# EasyEDA schematic 1-Schematic_OrionPRO-Original.json, sheets 1 to 2 of 6

## Sheets
1 MainModule: TITLE: Orion-PRO Основной модуль; REV: 3.21; Date: 2021-06-17; Sheet: 1/6; Drawn By: Romych; Company: zx-pk.ru
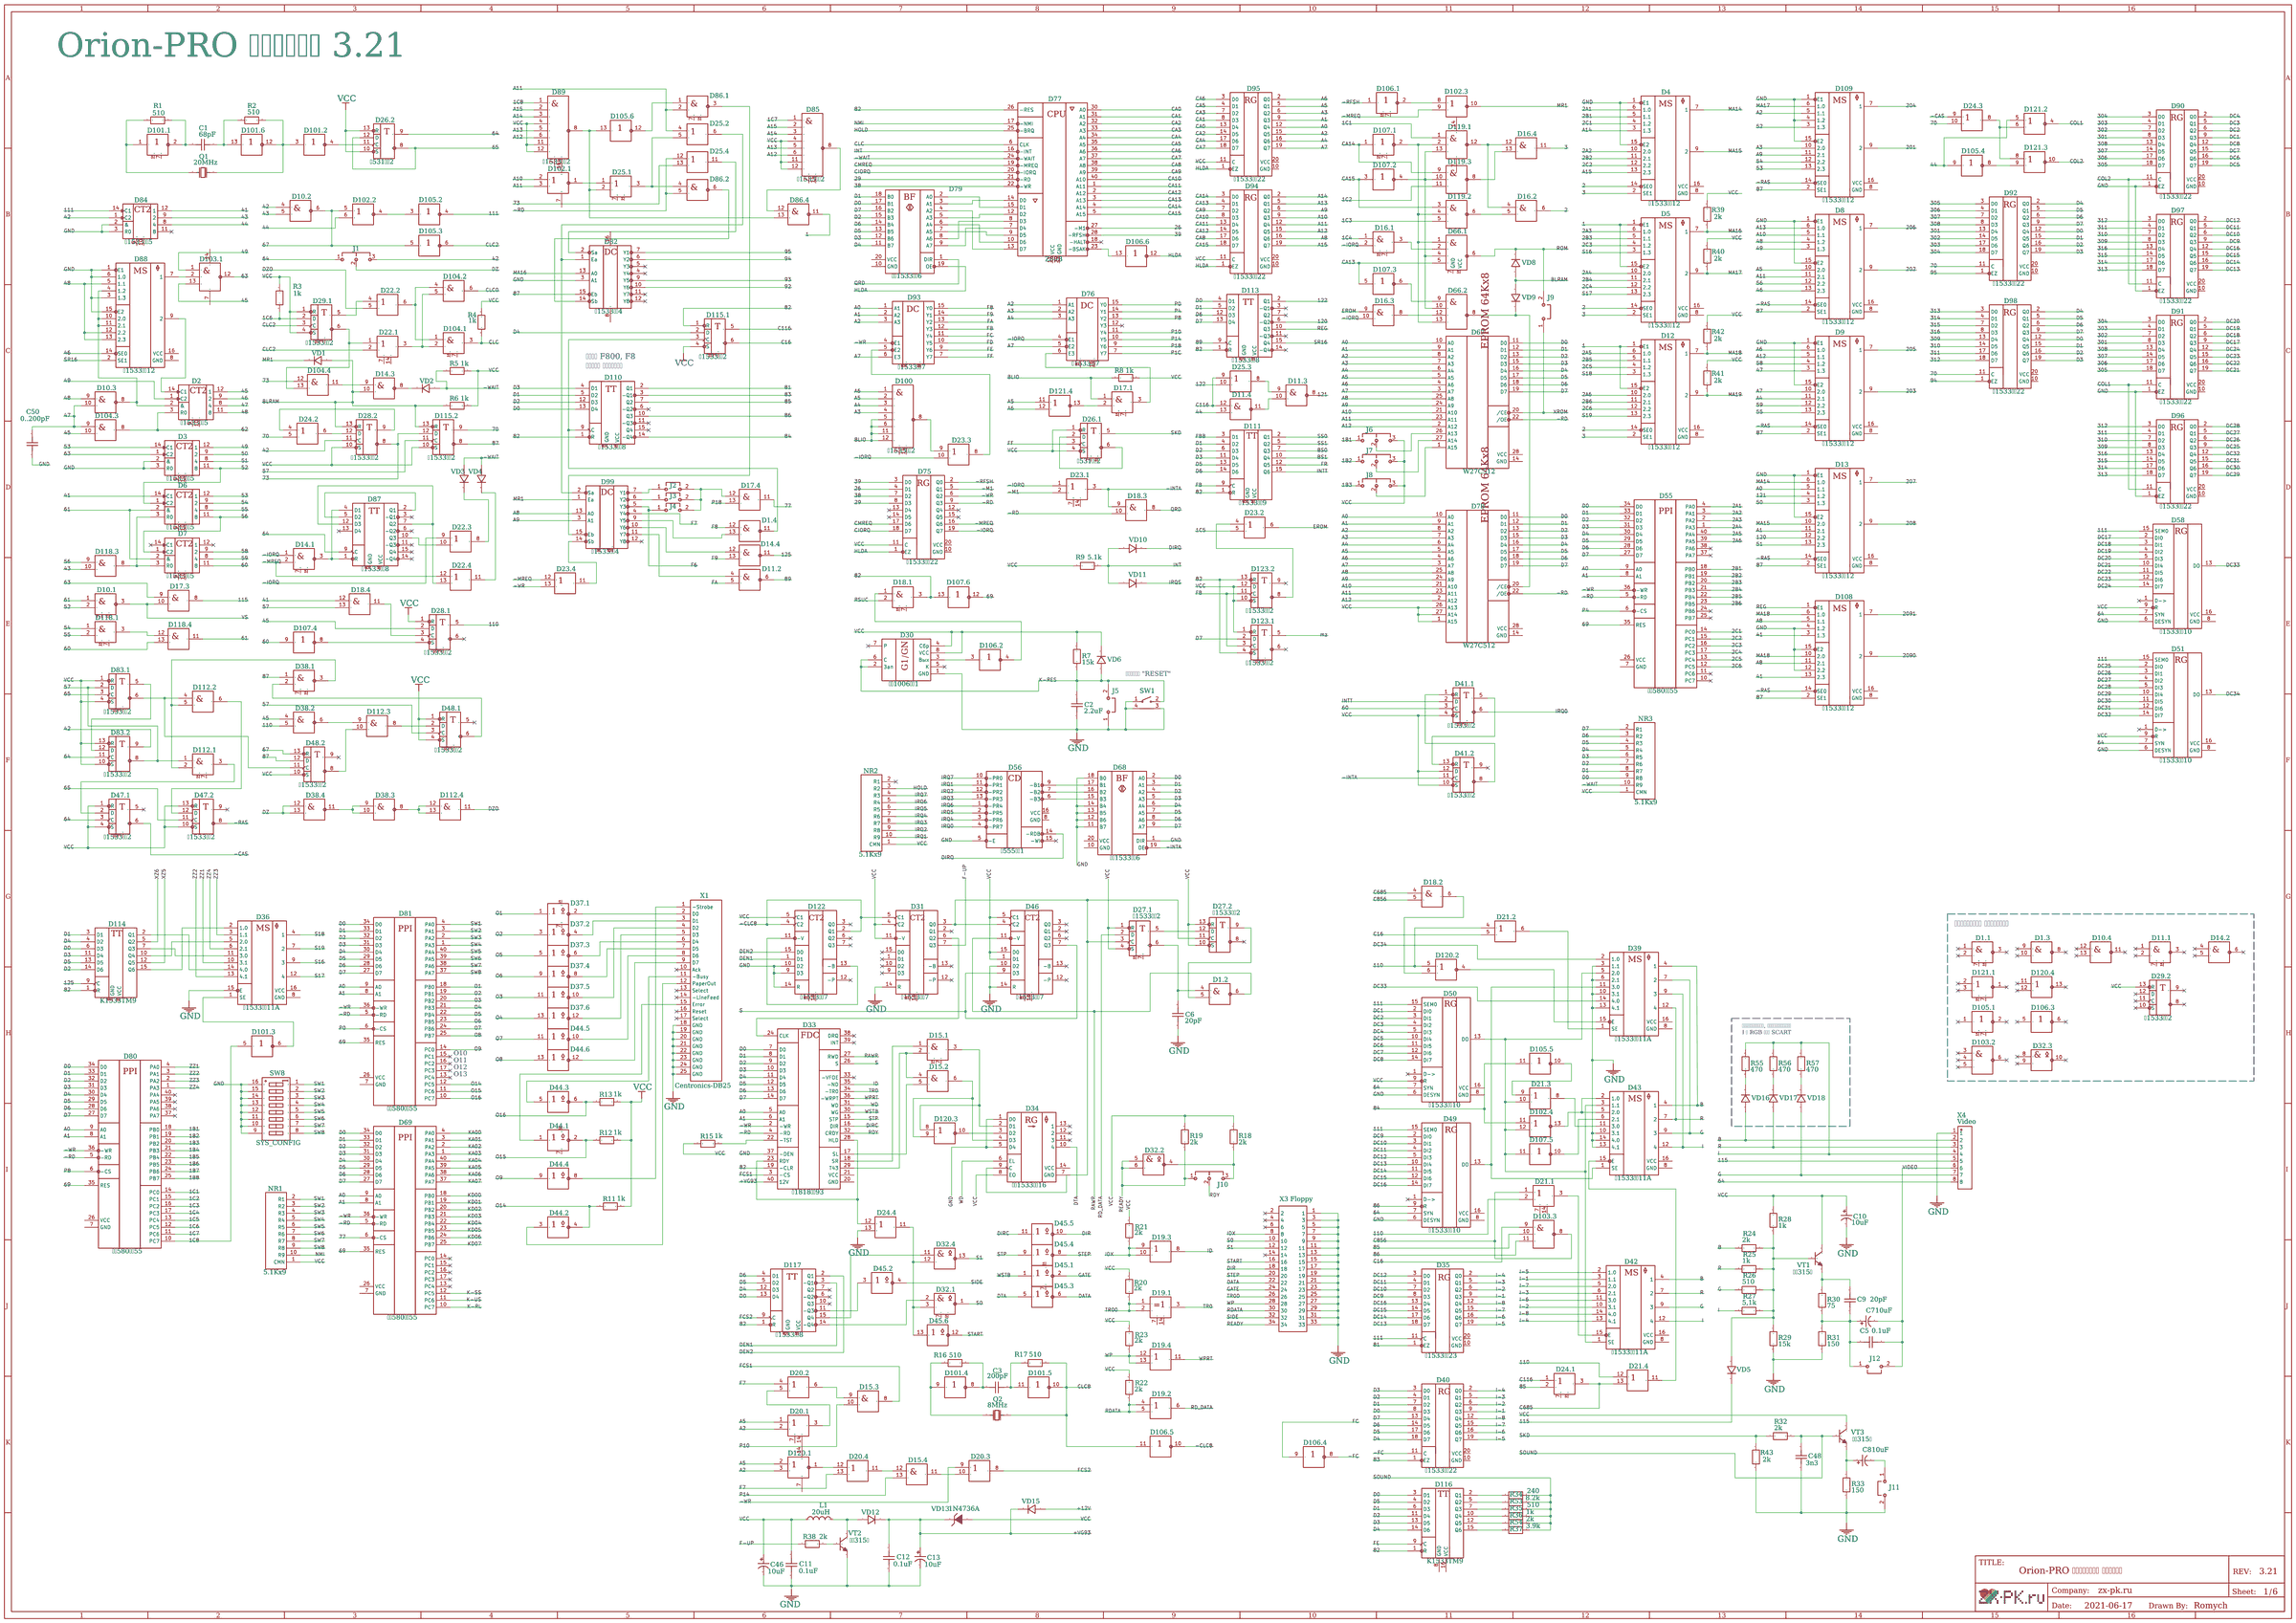
[diagram p0: MainModule]
2 MemoryModule: TITLE: Orion-PRO Динамическое ОЗУ; Date: 2021-10-23; Sheet: 2/6
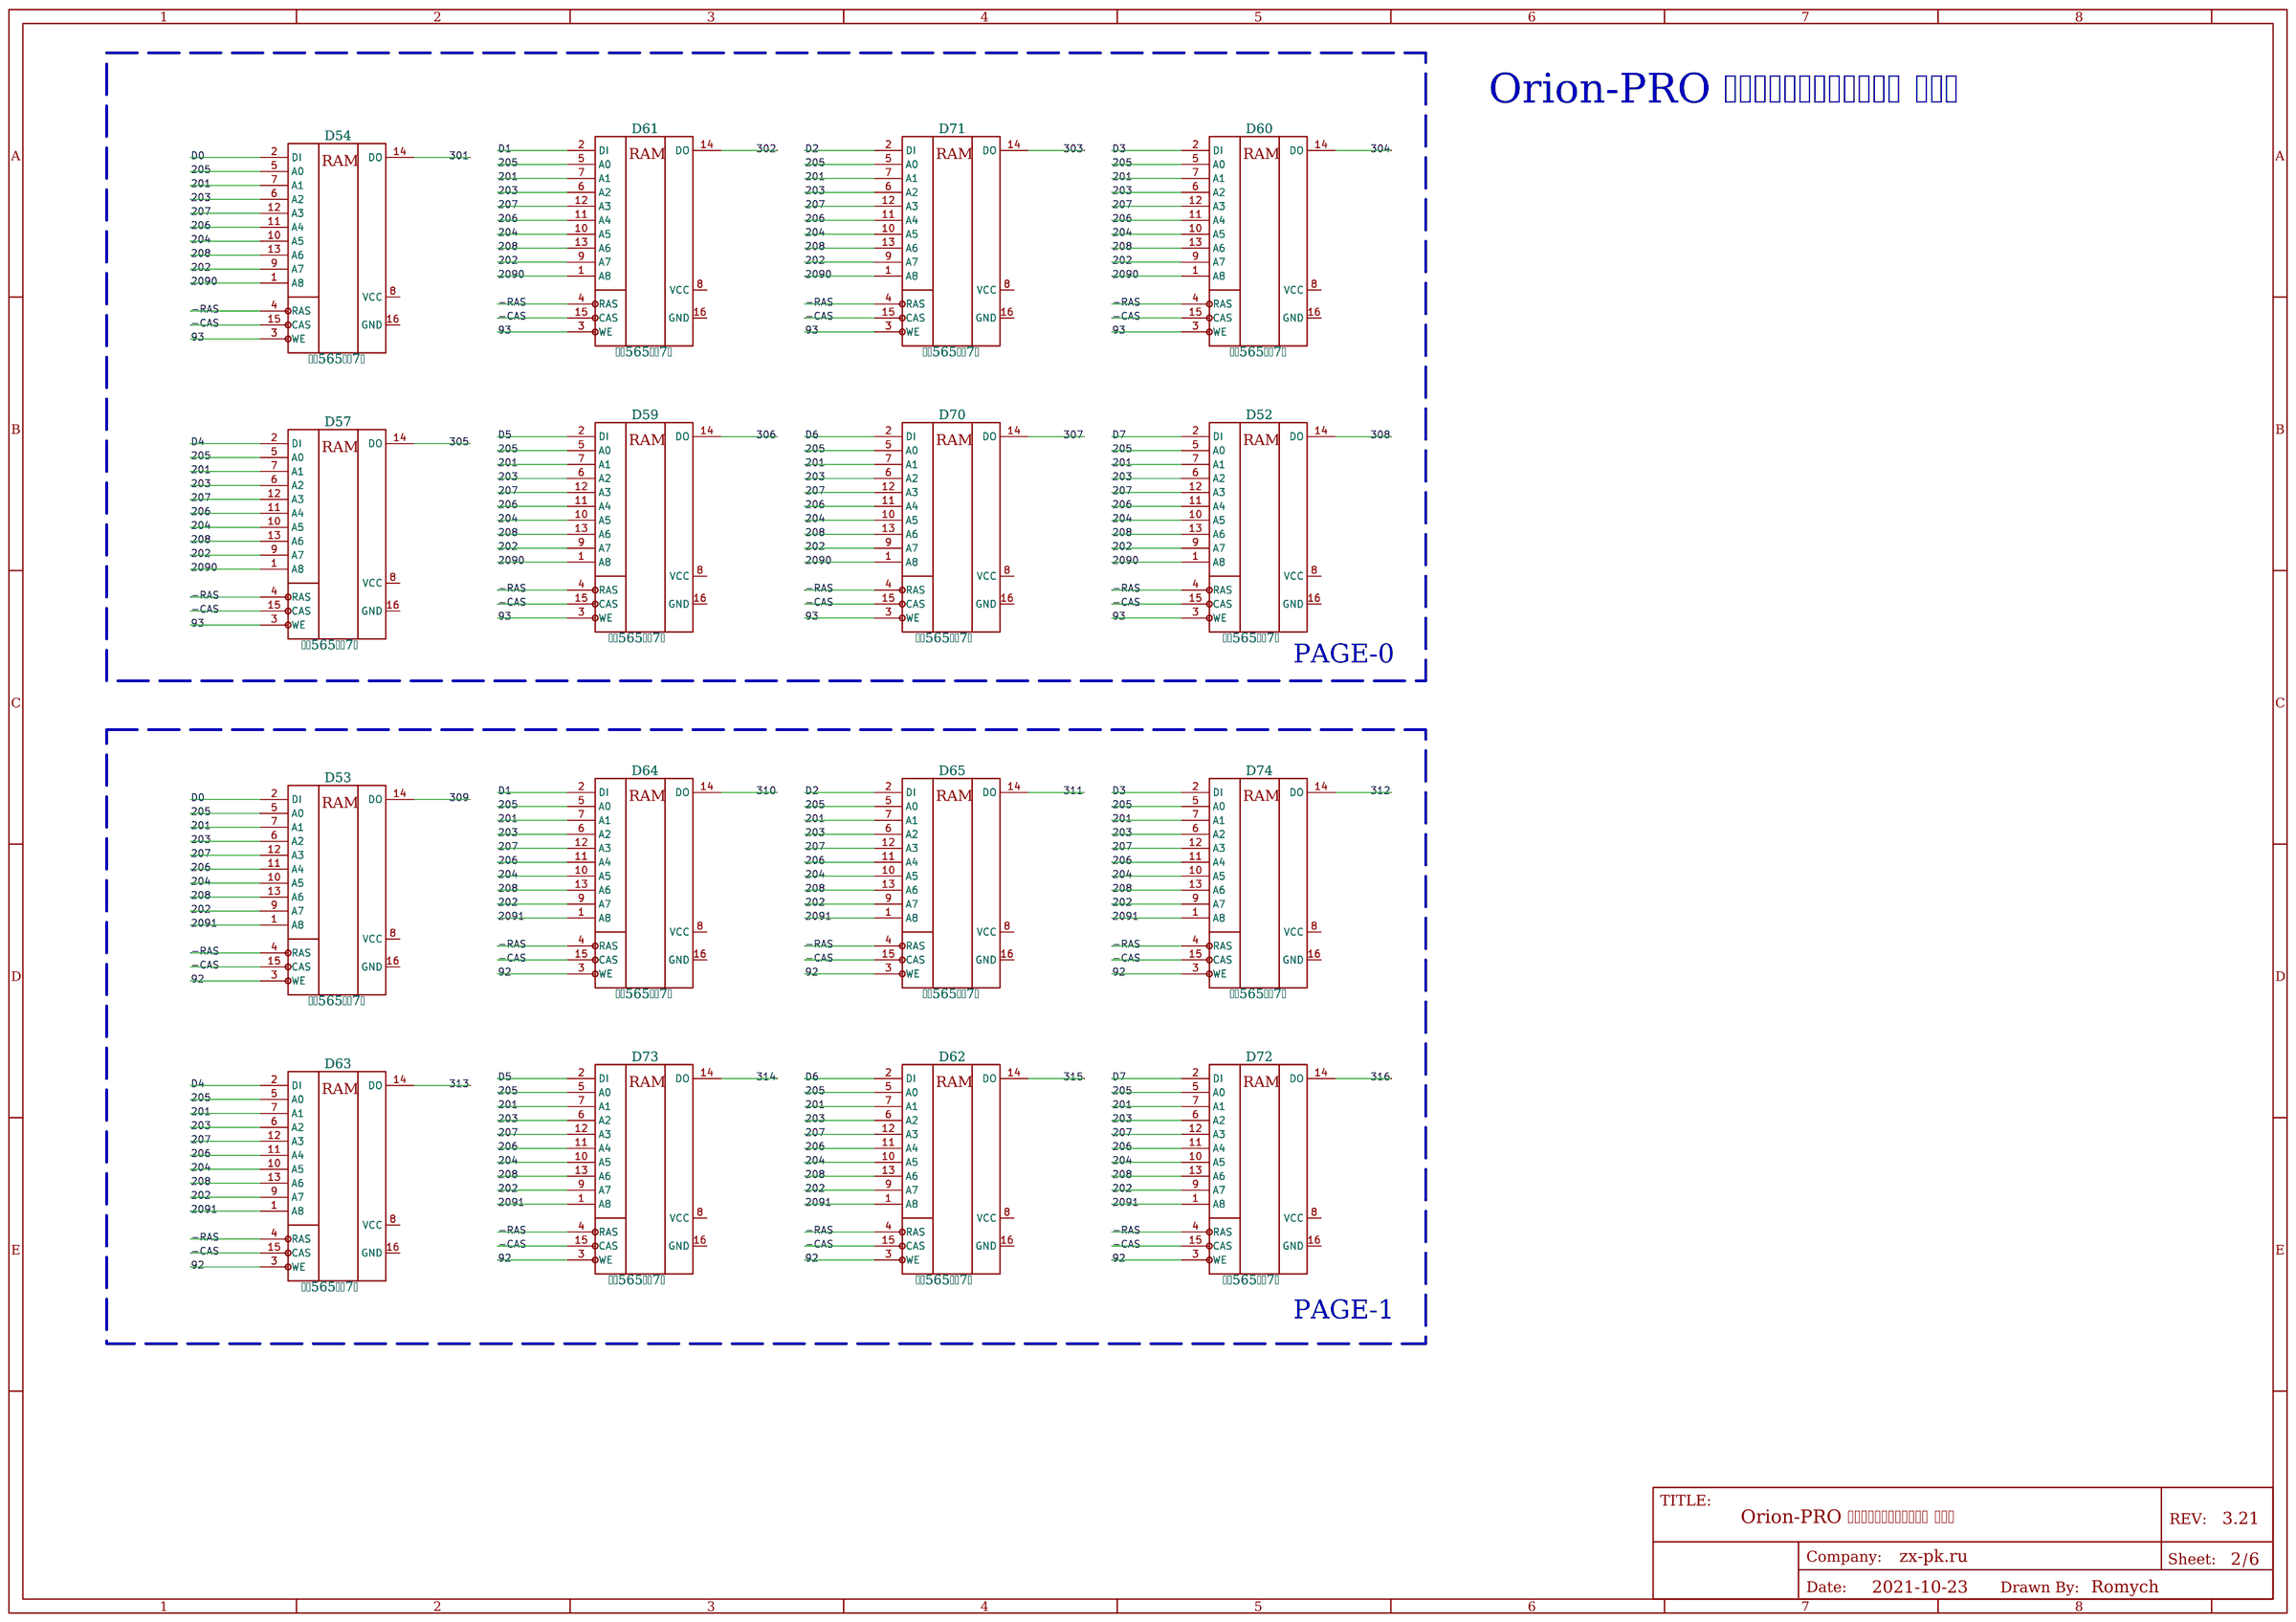
[diagram p1: MemoryModule]

## Parts
sheet Error404
D126  К1533ЛЕ4  [DIP-14_STD]  (sections 1,2,3)
D128  К1533ЛН1  [DIP-14_STD]  (sections 1,2,3,4,5,6)
sheet MainModule
C1  68pF  [CAP-TH_L5.08]
C2  2.2uF  [CAP-TH_L5.08]
C3  200pF  [CAP-TH_L5.08]
C5  0.1uF  [CAP-TH_L5.08]
C6  20pF  [CAP-TH_L7.0-W3.0-P5.00-D0.9]
C7  10uF  [CAP-TH_BD6.3-P2.50-D1.0-FD]
C8  10uF  [CAP-TH_BD6.3-P2.50-D1.0-FD]
C9  20pF  [CAP-TH_L5.08]
C10  10uF  [CAP-TH_BD6.3-P2.50-D1.0-FD]
C11  0.1uF  [CAP-TH_L7.62]
C12  0.1uF  [CAP-TH_L7.62]
C13  10uF  [CAP-TH_BD6.3-P2.50-D1.0-FD]
C46  10uF  [CAP-TH_5.08_P2.54_H12]
C48  3n3  [CAP-TH_L7.62]
C50  0..200pF  [CAP-TH_L5.08]
D1  К1533ЛА3  [DIP-14_STD]  (sections 1,2,3,4)
D2  К1533ИЕ5  [DIP-14_STD]
D3  К1533ИЕ5  [DIP-14_STD]
D4  К1533КП12  [DIP-16_STD]
D5  К1533КП12  [DIP-16_STD]
D6  К1533ИЕ5  [DIP-14_STD]
D7  К1533ИЕ5  [DIP-14_STD]
D8  К1533КП12  [DIP-16_STD]
D9  К1533КП12  [DIP-16_STD]
D10  К1533ЛА3  [DIP-14_STD]  (sections 1,2,3,4)
D11  К1533ЛА3  [DIP-14_STD]  (sections 1,2,3,4)
D12  К1533КП12  [DIP-16_STD]
D13  К1533КП12  [DIP-16_STD]
D14  К1533ЛА3  [DIP-14_STD]  (sections 1,2,3,4)
D15  К1533ЛИ1  [DIP-14_STD]  (sections 1,2,3,4)
D16  К1533ЛИ1  [DIP-14_STD]  (sections 1,2,3,4)
D17  К1533ЛИ1  [DIP-14_STD]  (sections 1,2,3,4)
D18  К1533ЛИ1  [DIP-14_STD]  (sections 1,2,3,4)
D19  К1533ЛЛ1  [DIP-14_STD]  (sections 1,2,3,4)
D20  К1533ЛЛ1  [DIP-14_STD]  (sections 1,2,3,4)
D21  К1533ЛЛ1  [DIP-14_STD]  (sections 1,2,3,4)
D22  К1533ЛЛ1  [DIP-14_STD]  (sections 1,2,3,4)
D23  К1533ЛЛ1  [DIP-14_STD]  (sections 1,2,3,4)
D24  К1533ЛЛ1  [DIP-14_STD]  (sections 1,2,3,4)
D25  К1533ЛЛ1  [DIP-14_STD]  (sections 1,2,3,4)
D26  К531ТМ2  [DIP-14_STD]  (sections 1,2)
D27  К1533ТМ2  [DIP-14_STD]  (sections 1,2)
D28  К1533ТМ2  [DIP-14_STD]  (sections 1,2)
D29  К1533ТМ2  [DIP-14_STD]  (sections 1,2)
D30  КР1006ВИ1  [DIP-8_L11.0-W7.6-P2.54-LS7.6-BL]
D31  К1533ИЕ7  [DIP-16_STD]
D32  К1533ЛА8  [DIP-14_STD]  (sections 1,2,3,4)
D33  К1818ВГ93  [DIP-40_L50.8-W17.8-P2.54-LS15.2-BL]
D34  КР1533ИР16  [DIP-14_STD]
D35  К1533ИР23  [DIP-20_STD]
D36  К1533КП11A  [DIP-16_STD]
D37  К1533ЛН2  [DIP-14_STD]  (sections 1,2,3,4,5,6)
D38  К1533ЛА3  [DIP-14_STD]  (sections 1,2,3,4)
D39  К1533КП11A  [DIP-16_STD]
D40  К1533ИР22  [DIP-20_STD]
D41  К1533ТМ2  [DIP-14_STD]  (sections 1,2)
D42  К1533КП11A  [DIP-16_STD]
D43  К1533КП11A  [DIP-16_STD]
D44  К1533ЛН2  [DIP-14_STD]  (sections 1,2,3,4,5,6)
D45  К1533ЛН2  [DIP-14_STD]  (sections 1,2,3,4,5,6)
D46  К1533ИЕ7  [DIP-16_STD]
D47  К1533ТМ2  [DIP-14_STD]  (sections 1,2)
D48  К1533ТМ2  [DIP-14_STD]  (sections 1,2)
D49  К1533ИР10  [DIP-16_STD]
D50  К1533ИР10  [DIP-16_STD]
D51  К1533ИР10  [DIP-16_STD]
D55  КР580ВВ55  [DIP-40_L50.8-W17.8-P2.54-LS15.2-BL]
D56  К555ИВ1  [DIP-16_STD]
D58  К1533ИР10  [DIP-16_STD]
D66  К1533ЛА1  [DIP-14_STD]  (sections 1,2)
D67  W27C512  [DIP-28_L35.6-W17.8-P2.54-LS15.2-BL]
D68  КР1533АП6  [DIP-20_STD]
D69  КР580ВВ55  [DIP-40_L50.8-W17.8-P2.54-LS15.2-BL]
D75  К1533ИР22  [DIP-20_STD]
D76  К1533ИД7  [DIP-16_STD]
D77  Z80B  [PDIP-40_L52.3-W13.8-P2.54-LS15.24-BL]
D78  W27C512  [DIP-28_L35.6-W17.8-P2.54-LS15.2-BL]
D79  КР1533АП6  [DIP-20_STD]
D80  КР580ВВ55  [DIP-40_L50.8-W17.8-P2.54-LS15.2-BL]
D81  КР580ВВ55  [DIP-40_L50.8-W17.8-P2.54-LS15.2-BL]
D82  К1533ИД4  [DIP-16_STD]
D83  К1533ТМ2  [DIP-14_STD]  (sections 1,2)
D84  К1533ИЕ5  [DIP-14_STD]
D85  К1533ЛА2  [DIP-14_STD]
D86  К1533ЛА3  [DIP-14_STD]  (sections 1,2,4)
D87  К1533ТМ8  [DIP-16_STD]
D88  К1533КП12  [DIP-16_STD]
D89  К1533ЛА2  [DIP-14_STD]
D90  К1533ИР22  [DIP-20_STD]
D91  К1533ИР22  [DIP-20_STD]
D92  К1533ИР22  [DIP-20_STD]
D93  К1533ИД7  [DIP-16_STD]
D94  К1533ИР22  [DIP-20_STD]
D95  К1533ИР22  [DIP-20_STD]
D96  К1533ИР22  [DIP-20_STD]
D97  К1533ИР22  [DIP-20_STD]
D98  К1533ИР22  [DIP-20_STD]
D99  К1533ИД4  [DIP-16_STD]
D100  К1533ЛА2  [DIP-14_STD]
D101  К1533ЛН1  [DIP-14_STD]  (sections 1,2,3,4,5,6)
D102  К1533ЛЕ1  [DIP-14_STD]  (sections 1,2,3,4)
D103  К1533ЛА4  [DIP-14_STD]  (sections 1,2,3)
D104  К1533ЛИ1  [DIP-14_STD]  (sections 1,2,3,4)
D105  К1533ЛН1  [DIP-14_STD]  (sections 1,2,3,4,5,6)
D106  К1533ЛН1  [DIP-14_STD]  (sections 1,2,3,4,5,6)
D107  К1533ЛН1  [DIP-14_STD]  (sections 1,2,3,4,5,6)
D108  К1533КП12  [DIP-16_STD]
D109  К1533КП12  [DIP-16_STD]
D110  К1533ТМ8  [DIP-16_STD]
D111  К1533ТМ9  [DIP-16_STD]
D112  К1533ЛИ1  [DIP-14_STD]  (sections 1,2,3,4)
D113  К1533ТМ8  [DIP-16_STD]
D114  K1533TM9  [DIP-16_STD]
D115  К1533ТМ2  [DIP-14_STD]  (sections 1,2)
D116  K1533TM9  [DIP-16_STD]
D117  К1533ТМ8  [DIP-16_STD]
D118  К1533ЛИ1  [DIP-14_STD]  (sections 1,3,4)
D119  К1533ЛА4  [DIP-14_STD]  (sections 1,2,3)
D120  К1533ЛЕ1  [DIP-14_STD]  (sections 1,2,3,4)
D121  К1533ЛЕ1  [DIP-14_STD]  (sections 1,2,3,4)
D122  К1533ИЕ7  [DIP-16_STD]
D123  К1533ТМ2  [DIP-14_STD]  (sections 1,2)
J1  Jumper-3PM  [HDR-TH_3P-P2.54-V-M]
J2  Jumper-2PM  [HDR-TH_2P-P2.54-V-M]
J3  Jumper-2PM  [HDR-TH_2P-P2.54-V-M]
J4  Jumper-2PM  [HDR-TH_2P-P2.54-V-M]
J5  Jumper-2PM  [HDR-TH_2P-P2.54-V-M]
J6  Jumper-3PM  [HDR-TH_3P-P2.54-V-M]
J7  Jumper-3PM  [HDR-TH_3P-P2.54-V-M]
J8  Jumper-3PM  [HDR-TH_3P-P2.54-V-M]
J9  Jumper-2PM  [HDR-TH_2P-P2.54-V-M]
J10  Jumper-3PM  [HDR-TH_3P-P2.54-V-M]
J11  Jumper-2PM  [HDR-TH_2P-P2.54-V-M]
J12  Jumper-2PM  [HDR-TH_2P-P2.54-V-M]
L1  20uH  [L_TH_17.78]
NR1  5.1Kx9  [HDR-TH_10P-P2.54-V-F]
NR2  5.1Kx9  [HDR-TH_10P-P2.54-V-F]
NR3  5.1Kx9  [HDR-TH_10P-P2.54-V-F]
Q1  20MHz  [OSC-49U-1]
Q2  8MHz  [OSC-49U-1]
R1  510  [R_0.25_10.16]
R2  510  [R_0.25_10.16]
R3  1k  [R_0.25_10.16]
R4  1k  [R_0.25_10.16]
R5  1k  [R_0.25_10.16]
R6  1k  [R_0.25_10.16]
R7  15k  [R_0.25_10.16]
R8  1k  [R_0.25_10.16]
R9  5.1k  [R_0.25_10.16]
R11  1k  [R_0.25_10.16]
R12  1k  [R_0.25_10.16]
R13  1k  [R_0.25_10.16]
R15  1k  [R_0.25_10.16]
R16  510  [R_0.25_10.16]
R17  510  [R_0.25_10.16]
R18  2k  [R_0.25_10.16]
R19  2k  [R_0.25_10.16]
R20  2k  [R_0.25_10.16]
R21  2k  [R_0.25_10.16]
R22  2k  [R_0.25_10.16]
R23  2k  [R_0.25_10.16]
R24  2k  [R_0.25_10.16]
R25  1k  [R_0.25_10.16]
R26  510  [R_0.25_10.16]
R27  5,1k  [R_0.25_10.16]
R28  1k  [R_0.25_10.16]
R29  15k  [R_0.25_10.16]
R30  75  [R_0.25_10.16]
R31  150  [R_0.125_V_TH]
R32  2k  [R_0.25_10.16]
R33  150  [R_0.25_10.16]
R34  240  [R_0.25_10.16]
R35  510  [R_0.25_10.16]
R36  1k  [R_0.25_10.16]
R37  3.9k  [R_0.25_10.16]
R38  2k  [R_0.25_10.16]
R39  2k  [R_0.25_10.16]
R40  2k  [R_0.25_10.16]
R41  2k  [R_0.25_10.16]
R42  2k  [R_0.25_10.16]
R43  2k  [R_0.25_10.16]
R53  8.2k  [R_0.25_10.16]
R54  2k  [R_0.25_10.16]
R55  470  [R_0.125_V_TH]
R56  470  [R_0.125_V_TH]
R57  470  [R_0.125_V_TH]
SW1  RESET-SW  [SW-TH_4P-L7.5-W6.5-P4.50]
SW8  SYS_CONFIG  [SW-TH_16P-L21.8-W9.6-P2.54-LS7.62]
VD1  1N4148  [D-TH_L10.16]
VD2  1N4148  [D-TH_L10.16]
VD3  1N4148  [D-TH_L10.16]
VD4  1N4148  [D-TH_L10.16]
VD5  1N4148  [D-TH_L10.16]
VD6  1N4148  [D_TH_7.62]
VD8  1N4148  [D-TH_L10.16]
VD9  1N4148  [D-TH_L10.16]
VD10  1N4148  [D-TH_L10.16]
VD11  1N4148  [D-TH_L10.16]
VD12  1N4148  [D-TH_L10.16]
VD13  1N4736A  [D-TH_L10.16]
VD15  1N4148  [D-TH_L10.16]
VD16  1N4148  [D_TH_2.54_V]
VD17  1N4148  [D_TH_2.54_V]
VD18  1N4148  [D_TH_2.54_V]
VT1  КТ315Б  [TO-92-3_L4.8-W3.7-P2.54-L]
VT2  КТ315Б  [TO-92-3_L4.8-W3.7-P2.54-L]
VT3  КТ315Б  [TO-92-3_L4.8-W3.7-P2.54-L]
X1  Centronics-DB25  [DB25-PCB-EDGE]
X3  Floppy  [IDC-TH_Z-231011834106]
X4  Video  [HDR-TH_8P-P2.54-V-M]
sheet MemoryModule
D52  КР565РУ7Г  [DIP-16_STD]
D53  КР565РУ7Г  [DIP-16_STD]
D54  КР565РУ7Г  [DIP-16_STD]
D57  КР565РУ7Г  [DIP-16_STD]
D59  КР565РУ7Г  [DIP-16_STD]
D60  КР565РУ7Г  [DIP-16_STD]
D61  КР565РУ7Г  [DIP-16_STD]
D62  КР565РУ7Г  [DIP-16_STD]
D63  КР565РУ7Г  [DIP-16_STD]
D64  КР565РУ7Г  [DIP-16_STD]
D65  КР565РУ7Г  [DIP-16_STD]
D70  КР565РУ7Г  [DIP-16_STD]
D71  КР565РУ7Г  [DIP-16_STD]
D72  КР565РУ7Г  [DIP-16_STD]
D73  КР565РУ7Г  [DIP-16_STD]
D74  КР565РУ7Г  [DIP-16_STD]

## Library data of the parts
D126 = К1533ЛЕ4: Supplier: chipdip; Contributor: Roman Boykov; subpart_no: 1
D107 D128 = К1533ЛН1: Supplier: chipdip; Contributor: Roman Boykov; subpart_no: 7
C1-C3 C5 C6 C9 C48 = CK45-R3AD152K-VRY: Supplier: LCSC; Supplier Part: C340608; Manufacturer: TDK; Contributor: LCSC
C7 C8 C10 C13 C46 = ECLJ0612220M101P00: Supplier: LCSC; Supplier Part: C156809; Manufacturer: Guangdong TOPAZ Elec Tech; Contributor: LCSC
C11 C12 C50 = CK45-R3AD152K-VRY: Supplier: LCSC; Supplier Part: C340608; Manufacturer: TDK; Contributor: LCSC; JLCPCB Part Class: Extended Part
D1 D11 = К1533ЛА3: Supplier: chipdip; Contributor: Roman Boykov; subpart_no: 4
D2 D3 D6 D7 D84 = К1533ИЕ5: Supplier: chipdip; Contributor: romychs_4693; subpart_no: 4
D4 D5 D8 D9 D12 D13 D88 D108 D109 = К1533КП12: Supplier: chipdip; Contributor: romychs_4693
D10 D14 D38 D86 = К1533ЛА3: Supplier: chipdip; Contributor: Roman Boykov; subpart_no: 1
D15-D18 D104 D112 D118 = К1533ЛИ1: Supplier: chipdip; Contributor: Roman Boykov; subpart_no: 1
D19 D23 = К1533ЛЛ1: Supplier: chipdip; Contributor: Roman Boykov; subpart_no: 3
D20 D22 D25 = К1533ЛЛ1: Supplier: chipdip; Contributor: Roman Boykov; subpart_no: 1
D21 = К1533ЛЛ1: Supplier: chipdip; Contributor: Roman Boykov; subpart_no: 2
D24 = К1533ЛЛ1: Supplier: chipdip; Contributor: Roman Boykov; subpart_no: 4
D26 = К531ТМ2: Supplier: chipdip; Contributor: Roman Boykov; subpart_no: 1
D27-D29 D41 D47 D48 D83 D115 D123 = К1533ТМ2: Supplier: chipdip; Contributor: romychs_4693; subpart_no: 3
D30 = КР1006ВИ1: Supplier: chipdip; Contributor: romychs_4693
D31 D46 D122 = К1533ИЕ7: Contributor: romychs_4693
D32 = К1533ЛА8: Supplier: chipdip; Contributor: Roman Boykov; subpart_no: 1
D33 = К1818ВГ93: link: ВГ93; FDD; Contributor: Roman Boykov
D34 = КР1533ИР16: Supplier: chipdip; Contributor: romychs_4693
D35 = К1533ИР23: Supplier: chipdip; link: TTL; Регистр; ИР23; Contributor: romychs_4693
D36 D39 D42 D43 = К1533КП11A: Supplier: chipdip; Contributor: Roman Boykov
D37 = К1533ЛН2: Supplier: chipdip; Contributor: Roman Boykov; subpart_no: 7
D40 D75 D90-D92 D94-D98 = К1533ИР22: Supplier: chipdip; link: TTL; Регистр; ИР22; Contributor: Roman Boykov
D44 = К1533ЛН2: Supplier: chipdip; Contributor: Roman Boykov; subpart_no: 2
D45 = К1533ЛН2: Supplier: chipdip; Contributor: Roman Boykov; subpart_no: 5
D49-D51 D58 = К1533ИР10: Supplier: chipdip; link: TTL; Регистр; ИР23; Contributor: Roman Boykov
D55 D69 D80 D81 = КР580ВВ55: Supplier: chipdip; Contributor: romychs_4693
D56 = К555ИВ1: Supplier: chipdip; Contributor: romychs_4693
D66 = К1533ЛА1: Supplier: chipdip; Contributor: romychs_4693; subpart_no: 1
D67 D78 = W27C512: Supplier: chipdip; Contributor: Roman Boykov
D68 D79 = КР1533АП6: Supplier: chipdip; Contributor: romychs_4693
D76 D93 = К1533ИД7: Supplier: chipdip; Contributor: romychs_4693; subpart_no: 4
D77 = Z80B: Manufacturer: Zilog; Contributor: romychs_4693
D82 D99 = К1533ИД4: Supplier: chipdip; Contributor: romychs_4693
D85 D89 D100 = К1533ЛА2: Supplier: chipdip; Contributor: Roman Boykov
D87 D110 D113 D117 = К1533ТМ8: Supplier: chipdip; Contributor: Roman Boykov
D101 = К1533ЛН1: Supplier: chipdip; Contributor: Roman Boykov; subpart_no: 10
D102 D120 = К1533ЛЕ1: Supplier: chipdip; Contributor: Roman Boykov; subpart_no: 1
D103 D119 = К1533ЛА4: Supplier: chipdip; Contributor: Roman Boykov; subpart_no: 1
D105 D106 = К1533ЛН1: Supplier: chipdip; Contributor: Roman Boykov; subpart_no: 8
D111 = К1533ТМ9: Supplier: chipdip; Contributor: Roman Boykov
D114 D116 = K1533TM9: Supplier: chipdip; Contributor: Roman Boykov
D121 = К1533ЛЕ1: Supplier: chipdip; Contributor: Roman Boykov; subpart_no: 3
J1 J6-J8 J10 = Jumper-3PM: Contributor: Roman Boykov
J2-J5 J9 J11 J12 = Jumper-2PM: Contributor: Roman Boykov
L1 = LGA0510-101KP52E: Supplier: LCSC; Manufacturer: FH; Supplier Part: C71328
NR1-NR3 = НР-9: Supplier: chipdip; Contributor: Roman Boykov
Q1 Q2 = X49UD12MSD2SC: Supplier: LCSC; Manufacturer: YXC; Supplier Part: C2188
R1-R9 R11-R13 R15-R43 R53-R57 = RN 1/8W 470R F T/B A1: Supplier: LCSC; Supplier Part: C433478; Manufacturer: TyoHM; Contributor: LCSC
SW1 = TS-1009-A6B3-D2-T2: Supplier: LCSC; Supplier Part: C720923; Manufacturer: Yuandi; Contributor: LCSC; LCSC Assembly: Yes; SMT Type: Extend; Paste Type: expand
SW8 = DP-08RP_C458097: Supplier: LCSC; Supplier Part: C458097; Manufacturer: Korean Hroparts Elec; Manufacturer Part: DP-08RP; Contributor: LCSC; LCSC Assembly: Yes; SMT Type: Extend; Paste Type: expand
VD1-VD6 VD8-VD12 VD15-VD18 = 1N4148: Contributor: EasyEDA
VD13 = 1N4742A: Supplier: LCSC; Manufacturer: Tak Cheong; Supplier Part: C113210
VT1-VT3 = 2SC1815-TA: Supplier: LCSC; Manufacturer: CJ; image: //image.lceda.cn/szlcsc/C41114.jpg; Supplier Part: C41114
X1 = Centronics-DB25: Contributor: romychs_4693
X3 = Z-231011834106: Supplier: LCSC; Supplier Part: C221069; Manufacturer: Nextronics Engineering; Contributor: LCSC
X4 = Header2.54mm 1*8P: Supplier Part: C49256; Supplier: LCSC; Manufacturer: ReliaPro
D52-D54 D57 D59-D65 D70-D74 = КР565РУ7Г: Supplier: chipdip; Contributor: Roman Boykov

## Nets
+12V: VD15.1(A) ; also on sheet 3 4
GND: C2.1 C6.1 C10.2 C11.2 C12.2 C13.2 C46.2 C48.1 C50.1 D3.2(&) D3.3(R0) D4.1(E1) D4.15(E2) D8.1(E1) D8.15(E2) D9.1(E1) D9.15(E2) D13.1(E1) D13.15(E2) D24.13(2) D30.1(GND) D31.14(R) D33.37(-DEN) D34.1(D0) D34.5(D4) D36.15(E) D39.3(1.1) D39.6(2.1) D39.10(3.1) D39.13(4.1) D43.10(3.1) D43.13(4.1) D43.14(4.0) D46.10(D2) D46.14(R) D49.6(DESYN) D50.6(DESYN) D51.6(DESYN) D56.5(-E) D58.6(DESYN) D68.1(DIR) D68.11(B7) D68.12(B6) D68.13(B5) D68.14(B4) D68.18(B0) D82.3(A1) D84.2(&) D84.3(R0) D88.1(E1) D88.3(1.3) D88.6(1.0) D88.15(E2) D90.1(EZ) D91.1(EZ) D96.1(EZ) D97.1(EZ) D108.4(1.2) D108.12(2.2) D108.15(E2) D109.1(E1) D109.4(1.2) D109.15(E2) D122.9(D3) D122.10(D2) D122.14(R) J5.1 J11.2 R29.2 R31.2 R33.2 R43.2 SW1.1 SW1.3 SW1.4 SW8.9(PIN9) SW8.10(PIN10) SW8.11(PIN11) SW8.12(PIN12) SW8.13(PIN13) SW8.14(PIN14) SW8.15(PIN16) SW8.16(PIN16) VT2.1(E) X1.18(GND) X1.19(GND) X1.20(GND) X1.21(GND) X1.22(GND) X1.23(GND) X1.24(GND) X1.25(GND) X3.1 X3.3 X3.5 X3.7 X3.9 X3.11 X3.13 X3.15 X3.17 X3.19 X3.21 X3.23 X3.25 X3.27 X3.29 X3.31 X3.33 X4.1 ; also on sheet 3 4 5 6
VCC: C10.1 C11.1 C46.1 D26.1(R) D26.4(S) D26.10(S) D26.13(R) D27.1(R) D27.4(S) D27.10(S) D27.13(R) D28.1(R) D28.10(S) D29.1(R) D29.4(S) D29.13(R) D30.4(Сбр) D30.8(VCC) D31.4(C2) D31.11(-V) D34.8(EO) D41.4(S) D41.10(S) D41.12(D) D46.1(D1) D46.5(C1) D46.15(D0) D47.1(R) D47.4(S) D47.10(S) D47.13(R) D48.1(R) D48.4(S) D48.10(S) D50.9(R) D51.9(R) D58.9(R) D75.11(C) D78.1(A15) D78.26(A13) D78.27(A14) D83.1(R) D83.4(S) D83.10(S) D83.13(R) D85.4 D85.11(7) D85.12(8) D89.4 D89.11(7) D89.12(8) D94.11(C) D95.11(C) D115.4(S) D115.10(S) D122.5(C1) D123.1(R) D123.10(S) D123.12(D) J6.3 J7.3 J8.3 L1.1 NR1.1(CMN) NR2.1(CMN) NR3.1(CMN) R3.1 R4.1 R5.2 R6.2 R7.2 R8.2 R9.2 R11.2 R12.2 R13.2 R15.1 R18.2 R19.2 R20.2 R21.2 R22.2 R23.2 R28.1 R39.2 R40.2 R41.2 R42.2 VD6.2(K) VD13.1(A) VT1.2(C) VT3.2(C) ; also on sheet 3 4 5 6
1: D5.1(E1) D5.15(E2) D12.1(E1) D12.15(E2) D86.11(3)
1B1: D80.18(PB0) J6.1 ; also on sheet 3
1B2: D80.19(PB1) J7.1 ; also on sheet 3
1B3: D80.20(PB2) J8.1 ; also on sheet 3
1B4: D80.21(PB3) ; also on sheet 3
1B5: D80.22(PB4) ; also on sheet 3
1B6: D80.23(PB5) ; also on sheet 3 6
1B7: D80.24(PB6) ; also on sheet 3 6
1B8: D80.25(PB7) ; also on sheet 3 6
1C1: D80.14(PC0) D119.1(I1)
1C2: D80.15(PC1) D119.11(I3)
1C3: D80.16(PC2) D119.5(I3)
1C4: D16.1 D80.17(PC3)
1C5: D23.5(2) D80.13(PC4)
1C6: D29.2(D) D80.12(PC5) R3.2
1C7: D80.11(PC6) D85.1
1C8: D17.4(1) D80.10(PC7) D89.1 D101.5(1)
2: D4.14(SE0) D5.14(SE0) D12.14(SE0) D16.6(3)
2A1: D4.6(1.0) D55.4(PA0)
2A2: D4.10(2.0) D55.3(PA1)
2A3: D5.6(1.0) D55.2(PA2)
2A4: D5.10(2.0) D55.1(PA3)
2A5: D12.6(1.0) D55.40(PA4)
2A6: D12.10(2.0) D55.39(PA5)
2B1: D4.5(1.1) D55.18(PB0)
2B2: D4.11(2.1) D55.19(PB1)
2B3: D5.5(1.1) D55.20(PB2)
2B4: D5.11(2.1) D55.21(PB3)
2B5: D12.5(1.1) D55.22(PB4)
2B6: D12.11(2.1) D55.23(PB5)
2C1: D4.4(1.2) D55.14(PC0)
2C2: D4.12(2.2) D55.15(PC1)
2C3: D5.4(1.2) D55.16(PC2)
2C4: D5.12(2.2) D55.17(PC3)
2C5: D12.4(1.2) D55.13(PC4)
2C6: D12.12(2.2) D55.12(PC5)
3: D4.2(SE1) D5.2(SE1) D12.2(SE1) D16.11(3)
26: D75.4(D1) D77.27(-M1)
29: D75.8(D3) D77.21(-RD)
38: D75.7(D2) D77.22(-WR)
39: D75.3(D0) D77.28(-RFSH)
41: D6.14(C1) D18.12(1) D84.12(1) D108.3(1.3) D108.13(2.3)
42: D10.4(1) D28.11(C) D83.9(Q) D84.1(C2) J1.3 ; also on sheet 3
43: D10.5(2) D84.9(2) D118.10(2)
44: D11.13(2) D84.8(4) D102.6(2) D105.9(1) D121.5(1)
45: D2.12(1) D28.2(D) D38.4(1) D103.13(I3) D104.10(2)
46: D2.9(2) D8.13(2.3) D88.14(SE0)
47: C50.2 D2.8(4) D9.3(1.3) D10.10(2) D104.9(1)
48: D2.11(8) D8.4(1.2) D10.9(1) D88.5(1.1) D88.12(2.2) D88.13(2.3)
49: D2.1(C2) D3.12(1) D8.3(1.3) D103.1(I1)
50: D3.9(2) D13.3(1.3)
51: D3.8(4) D13.13(2.3)
52: D3.11(8) D6.1(C2) D10.2 D109.3(1.3)
53: D3.14(C1) D6.12(1) D109.13(2.3)
54: D6.9(2) D109.12(2.2) D118.1
55: D6.8(4) D9.13(2.3) D118.2
56: D6.11(8) D7.1(C2) D8.12(2.2) D118.9(1)
57: D18.13(2) D48.3(С) D83.2(D) D83.8(-Q) D112.1 D115.11(C)
58: D7.9(2) D9.4(1.2)
59: D7.8(4) D9.12(2.2)
60: D7.11(8) D41.3(С) D107.9(1) D118.13(2)
61: D6.2(&) D7.2(&) D10.1 D118.11(3)
62: D2.3(R0) D104.8(3)
63: D3.1(C2) D17.9(1) D103.12(O)
64: D26.9(Q) D47.3(С) D49.7(SYN) D50.7(SYN) D51.7(SYN) D58.7(SYN) D83.11(C) D87.9(C) J1.1 X4.8 ; also on sheet 3
65: D26.8(&#126;Q) D26.12(D) D47.11(C) D83.3(С)
67: D10.6(3) D48.13(R) D102.5(1) D105.5(1)
69: D55.35(RES) D69.35(RES) D80.35(RES) D81.35(RES) D107.12(2)
70: D24.5(2) D24.10(2) D92.11(C) D98.11(C) D115.9(Q)
73: D25.13(2) D28.8(-Q) D104.12(1) D115.12(D)
77: D17.11(3) D69.6(-CS)
81: D35.1(EZ) D110.2(Q1)
82: D18.3 D33.19(-CLR) D77.26(-RES) D107.13(1) D110.1(R) D111.1(R) D113.1(R) D114.1(R) D115.1(R) D116.1(R) D117.1(R) D123.4(S) D123.13(R) ; also on sheet 3 6
83: D40.1(EZ) D110.3(-Q1)
84: D102.11(1) D105.11(1) D110.14(-Q4)
85: D24.2 D103.10(I2) D110.7(Q2)
86: D49.9(R) D103.11(I3) D110.10(Q3)
87: D8.2(SE1) D9.2(SE1) D13.2(SE1) D38.1 D48.12(D) D82.15(Eb) D108.2(SE1) D109.2(SE1) D115.8(-Q)
89: D11.6(3) D113.9(C)
92: D53.3(WE) D62.3(WE) D63.3(WE) D64.3(WE) D65.3(WE) D72.3(WE) D73.3(WE) D74.3(WE) D82.10(Y6)
93: D52.3(WE) D54.3(WE) D57.3(WE) D59.3(WE) D60.3(WE) D61.3(WE) D70.3(WE) D71.3(WE) D82.9(Y5)
94: D82.6(Y2) D98.1(EZ)
95: D82.7(Y1) D92.1(EZ)
110: D21.2 D21.4(1) D21.12(1) D28.5(Q) D38.5(2) D120.5(1) ; also on sheet 3
111: D35.11(C) D49.15(SEM0) D50.15(SEM0) D51.15(SEM0) D58.15(SEM0) D84.14(C1) D105.4(2)
115: D17.8(3) VD5.2(K) X4.5 ; also on sheet 3
120: D13.12(2.2) D113.6(-Q2)
121: D11.8(3) D13.4(1.2)
122: D25.10(2) D113.2(Q1)
125: D14.11(3) D114.9(C)
201: D52.7(A1) D53.7(A1) D54.7(A1) D57.7(A1) D59.7(A1) D60.7(A1) D61.7(A1) D62.7(A1) D63.7(A1) D64.7(A1) D65.7(A1) D70.7(A1) D71.7(A1) D72.7(A1) D73.7(A1) D74.7(A1) D109.9(2)
202: D8.9(2) D52.9(A7) D53.9(A7) D54.9(A7) D57.9(A7) D59.9(A7) D60.9(A7) D61.9(A7) D62.9(A7) D63.9(A7) D64.9(A7) D65.9(A7) D70.9(A7) D71.9(A7) D72.9(A7) D73.9(A7) D74.9(A7)
203: D9.9(2) D52.6(A2) D53.6(A2) D54.6(A2) D57.6(A2) D59.6(A2) D60.6(A2) D61.6(A2) D62.6(A2) D63.6(A2) D64.6(A2) D65.6(A2) D70.6(A2) D71.6(A2) D72.6(A2) D73.6(A2) D74.6(A2)
204: D52.10(A5) D53.10(A5) D54.10(A5) D57.10(A5) D59.10(A5) D60.10(A5) D61.10(A5) D62.10(A5) D63.10(A5) D64.10(A5) D65.10(A5) D70.10(A5) D71.10(A5) D72.10(A5) D73.10(A5) D74.10(A5) D109.7(1)
205: D9.7(1) D52.5(A0) D53.5(A0) D54.5(A0) D57.5(A0) D59.5(A0) D60.5(A0) D61.5(A0) D62.5(A0) D63.5(A0) D64.5(A0) D65.5(A0) D70.5(A0) D71.5(A0) D72.5(A0) D73.5(A0) D74.5(A0)
206: D8.7(1) D52.11(A4) D53.11(A4) D54.11(A4) D57.11(A4) D59.11(A4) D60.11(A4) D61.11(A4) D62.11(A4) D63.11(A4) D64.11(A4) D65.11(A4) D70.11(A4) D71.11(A4) D72.11(A4) D73.11(A4) D74.11(A4)
207: D13.7(1) D52.12(A3) D53.12(A3) D54.12(A3) D57.12(A3) D59.12(A3) D60.12(A3) D61.12(A3) D62.12(A3) D63.12(A3) D64.12(A3) D65.12(A3) D70.12(A3) D71.12(A3) D72.12(A3) D73.12(A3) D74.12(A3)
208: D13.9(2) D52.13(A6) D53.13(A6) D54.13(A6) D57.13(A6) D59.13(A6) D60.13(A6) D61.13(A6) D62.13(A6) D63.13(A6) D64.13(A6) D65.13(A6) D70.13(A6) D71.13(A6) D72.13(A6) D73.13(A6) D74.13(A6)
301: D54.14(DO) D90.8(D3) D91.8(D3) D92.13(D4)
302: D61.14(DO) D90.7(D2) D91.7(D2) D92.14(D5)
303: D71.14(DO) D90.4(D1) D91.4(D1) D92.17(D6)
304: D60.14(DO) D90.3(D0) D91.3(D0) D92.18(D7)
305: D57.14(DO) D90.18(D7) D91.18(D7) D92.3(D0)
306: D59.14(DO) D90.17(D6) D91.17(D6) D92.4(D1)
307: D70.14(DO) D90.14(D5) D91.14(D5) D92.7(D2)
308: D52.14(DO) D90.13(D4) D91.13(D4) D92.8(D3)
309: D53.14(DO) D96.8(D3) D97.8(D3) D98.13(D4)
310: D64.14(DO) D96.7(D2) D97.7(D2) D98.14(D5)
311: D65.14(DO) D96.4(D1) D97.4(D1) D98.17(D6)
312: D74.14(DO) D96.3(D0) D97.3(D0) D98.18(D7)
313: D63.14(DO) D96.18(D7) D97.18(D7) D98.3(D0)
314: D73.14(DO) D96.17(D6) D97.17(D6) D98.4(D1)
315: D62.14(DO) D96.14(D5) D97.14(D5) D98.7(D2)
316: D72.14(DO) D96.13(D4) D97.13(D4) D98.8(D3)
2090: D52.1(A8) D54.1(A8) D57.1(A8) D59.1(A8) D60.1(A8) D61.1(A8) D70.1(A8) D71.1(A8) D108.9(2)
2091: D53.1(A8) D62.1(A8) D63.1(A8) D64.1(A8) D65.1(A8) D72.1(A8) D73.1(A8) D74.1(A8) D108.7(1)
+VG93: C12.1 C13.1 D33.40(12V) VD12.2(K) VD13.2(K) VD15.2(K)
-CAS: D24.9(1) D47.6(&#126;Q) D52.15(CAS) D53.15(CAS) D54.15(CAS) D57.15(CAS) D59.15(CAS) D60.15(CAS) D61.15(CAS) D62.15(CAS) D63.15(CAS) D64.15(CAS) D65.15(CAS) D70.15(CAS) D71.15(CAS) D72.15(CAS) D73.15(CAS) D74.15(CAS)
-CLC8: D31.5(C1) D106.10(2) D122.2(Q1) D122.4(C2)
-FC: D40.11(C) D106.8(2)
-INTA: D18.9(1) D23.3 D41.11(C) D68.19(OE) ; also on sheet 3
-IORQ: D14.1 D16.2 D16.10(2) D22.9(1) D23.1 D23.10(2) D75.19(Q7) D76.4(E1) ; also on sheet 3
-M1: D23.2 D75.5(Q1) ; also on sheet 3
-MREQ: D14.2 D22.12(1) D23.12(1) D75.16(Q6) D102.9(2) ; also on sheet 3
-RAS: D8.14(SE0) D9.14(SE0) D13.14(SE0) D47.8(-Q) D52.4(RAS) D53.4(RAS) D54.4(RAS) D57.4(RAS) D59.4(RAS) D60.4(RAS) D61.4(RAS) D62.4(RAS) D63.4(RAS) D64.4(RAS) D65.4(RAS) D70.4(RAS) D71.4(RAS) D72.4(RAS) D73.4(RAS) D74.4(RAS) D108.14(SE0) D109.14(SE0)
-RD: D18.10(2) D25.12(1) D33.4(-RD) D55.5(-RD) D67.22(/OE) D69.5(-RD) D75.9(Q3) D78.22(/OE) D80.5(-RD) D81.5(-RD) D86.5(2) ; also on sheet 3
-RFSH: D75.2(Q0) D106.1 ; also on sheet 3
-WAIT: D77.24(-WAIT) NR3.10(R9) R5.1 VD2.1(A) VD3.1(A) VD4.1(A) ; also on sheet 3
-WR: D20.9(1) D23.13(2) D33.2(-WR) D55.36(-WR) D69.36(-WR) D75.6(Q2) D80.36(-WR) D81.36(-WR) D93.4(E1) ; also on sheet 3
A0: D13.5(1.1) D33.5(A0) D55.9(A0) D67.10(A0) D69.9(A0) D78.10(A0) D80.9(A0) D81.9(A0) D93.1(A1) D95.12(Q4) ; also on sheet 3
A1: D13.11(2.1) D33.6(A1) D55.8(A1) D67.9(A1) D69.8(A1) D78.9(A1) D80.8(A1) D81.8(A1) D93.2(A2) D95.9(Q3) ; also on sheet 3
A2: D20.2 D67.8(A2) D76.1(A1) D78.8(A2) D93.3(A3) D95.15(Q5) D109.5(1.1) D120.3(2) ; also on sheet 3
A3: D67.7(A3) D76.2(A2) D78.7(A3) D95.6(Q2) D100.4 D109.10(2.0) ; also on sheet 3
A4: D9.11(2.1) D67.6(A4) D76.3(A3) D78.6(A4) D95.16(Q6) D100.3 ; also on sheet 3
A5: D8.10(2.0) D20.1 D67.5(A5) D78.5(A5) D95.5(Q1) D100.2 D120.2(1) D121.11(1) ; also on sheet 3
A6: D9.6(1.0) D67.4(A6) D78.4(A6) D95.2(Q0) D100.1 D121.12(2) ; also on sheet 3
A7: D9.10(2.0) D67.3(A7) D76.5(E2) D78.3(A7) D93.6(E3) D95.19(Q7) ; also on sheet 3
A8: D67.25(A8) D78.25(A8) D94.16(Q6) D99.13(A0) D108.5(1.1) D108.11(2.1) ; also on sheet 3
A9: D67.24(A9) D78.24(A9) D94.6(Q2) D99.3(A1) D109.11(2.1) ; also on sheet 3
A10: D8.5(1.1) D67.21(A10) D78.21(A10) D94.9(Q3) D102.2(1) ; also on sheet 3
A11: D8.11(2.1) D25.4(1) D67.23(A11) D78.23(A11) D86.2 D94.12(Q4) D102.3(2) ; also on sheet 3
A12: D9.5(1.1) D67.2(A12) D78.2(A12) D85.6 D89.6 D94.15(Q5) ; also on sheet 3
A13: D8.6(1.0) D85.5 D89.5 D94.5(Q1) ; also on sheet 3
A14: D4.3(1.3) D85.3 D89.3 D94.2(Q0) D126.5(I3) ; also on sheet 3
A15: D4.13(2.3) D85.2 D89.2 D94.19(Q7) D126.4(I2) ; also on sheet 3
B: D39.4(1) D42.4(1) D43.4(1) R24.2 VD16.1(A) X4.2 ; also on sheet 3
BLIO: D17.1 D100.5 D100.6 D100.11(7) D100.12(8) R8.1 ; also on sheet 3
BLRAM: D14.10(2) D28.13(R) D115.13(R) R6.1 VD1.1(A) VD8.1(A) VD9.1(A) ; also on sheet 3
BS0: D111.7(Q3) ; also on sheet 6
BS1: D111.10(Q4) ; also on sheet 6
C16: D21.5(2) D103.9(I1) D115.6(&#126;Q)
C116: D11.12(1) D24.1 D25.9(1) D115.5(Q)
C685: D18.4(1) D21.13(2) D24.3
C856: D18.5(2) D21.1 D103.8(O)
CA0: D77.30(A0) D95.13(D4)
CA1: D77.31(A1) D95.8(D3)
CA2: D77.32(A2) D95.14(D5)
CA3: D77.33(A3) D95.7(D2)
CA4: D77.34(A4) D95.17(D6)
CA5: D77.35(A5) D95.4(D1)
CA6: D77.36(A6) D95.3(D0)
CA7: D77.37(A7) D95.18(D7)
CA8: D77.38(A8) D94.17(D6)
CA9: D77.39(A9) D94.7(D2)
CA10: D77.40(A10) D94.8(D3)
CA11: D77.1(A11) D94.13(D4)
CA12: D77.2(A12) D94.14(D5)
CA13: D66.5(4) D77.3(A13) D94.4(D1) D107.5(1)
CA14: D77.4(A14) D94.3(D0) D107.1 D119.9(I1)
CA15: D77.5(A15) D94.18(D7) D107.3(1) D119.3(I1)
CIORQ: D75.18(D7) D77.20(-IORQ)
CLC: D77.6(CLK) D104.3 R4.2
CLC0: D104.6(3) ; also on sheet 3
CLC2: D22.2 D29.3(С) D105.6(2)
CLC8: D101.10(2) D106.11(1) Q2.1(OSC1) R17.2
CMREQ: D75.17(D6) D77.19(-MREQ)
COL1: D91.11(C) D96.11(C) D121.4(3)
COL2: D90.11(C) D97.11(C) D121.10(3)
D0: D33.7(D0) D40.8(D3) D53.2(DI) D54.2(DI) D55.34(D0) D67.11(D0) D68.2(A0) D69.34(D0) D78.11(D0) D79.17(B1) D80.34(D0) D81.34(D0) D92.12(Q4) D98.12(Q4) D110.13(D4) D113.4(D1) D114.6(D3) D116.3(D1) D117.13(D4) NR3.9(R8) ; also on sheet 3 6
D1: D33.8(D1) D40.7(D2) D55.33(D1) D61.2(DI) D64.2(DI) D67.12(D1) D68.3(A1) D69.33(D1) D78.12(D1) D79.18(B0) D80.33(D1) D81.33(D1) D92.15(Q5) D98.15(Q5) D110.5(D2) D111.4(D2) D113.5(D2) D114.3(D1) D116.6(D3) NR3.8(R7) ; also on sheet 3 6
D2: D33.9(D2) D40.4(D1) D55.32(D2) D65.2(DI) D67.13(D2) D68.4(A2) D69.32(D2) D71.2(DI) D78.13(D2) D79.15(B3) D80.32(D2) D81.32(D2) D92.16(Q6) D98.16(Q6) D110.12(D3) D111.6(D3) D114.14(D6) D116.11(D4) NR3.7(R6) ; also on sheet 3 6
D3: D33.10(D3) D40.3(D0) D55.31(D3) D60.2(DI) D67.15(D3) D68.5(A3) D69.31(D3) D74.2(DI) D78.15(D3) D79.12(B6) D80.31(D3) D81.31(D3) D92.19(Q7) D98.19(Q7) D110.4(D1) D111.11(D4) D114.11(D4) D116.13(D5) NR3.6(R5) ; also on sheet 3 6
D4: D33.11(D4) D40.18(D7) D55.30(D4) D57.2(DI) D63.2(DI) D67.16(D4) D68.6(A4) D69.30(D4) D78.16(D4) D79.11(B7) D80.30(D4) D81.30(D4) D92.2(Q0) D98.2(Q0) D114.4(D2) D115.2(D) D116.14(D6) D117.12(D3) NR3.5(R4) ; also on sheet 3
D5: D33.12(D5) D40.17(D6) D55.29(D5) D59.2(DI) D67.17(D5) D68.7(A5) D69.29(D5) D73.2(DI) D78.17(D5) D79.13(B5) D80.29(D5) D81.29(D5) D92.5(Q1) D98.5(Q1) D111.13(D5) D114.13(D5) D116.4(D2) D117.5(D2) NR3.4(R3) ; also on sheet 3 6
D6: D33.13(D6) D40.14(D5) D55.28(D6) D62.2(DI) D67.18(D6) D68.8(A6) D69.28(D6) D70.2(DI) D78.18(D6) D79.14(B4) D80.28(D6) D81.28(D6) D92.6(Q2) D98.6(Q2) D111.14(D6) D113.12(D3) D117.4(D1) NR3.3(R2) ; also on sheet 3 6
D7: D33.14(D7) D40.13(D4) D52.2(DI) D55.27(D7) D67.19(D7) D68.9(A7) D69.27(D7) D72.2(DI) D78.19(D7) D79.16(B2) D80.27(D7) D81.27(D7) D92.9(Q3) D98.9(Q3) D113.13(D4) D123.2(D) NR3.2(R1) ; also on sheet 3 6
DATA: D45.6(2) X3.22
DC1: D50.2(DI0) D90.9(Q3)
DC2: D50.3(DI1) D90.6(Q2)
DC3: D50.4(DI2) D90.5(Q1)
DC4: D50.5(DI3) D90.2(Q0)
DC5: D50.10(DI4) D90.19(Q7)
DC6: D50.11(DI5) D90.16(Q6)
DC7: D50.12(DI6) D90.15(Q5)
DC8: D50.14(DI7) D90.12(Q4)
DC9: D35.8(D3) D49.2(DI0) D97.9(Q3)
DC10: D35.7(D2) D49.3(DI1) D97.6(Q2)
DC11: D35.4(D1) D49.4(DI2) D97.5(Q1)
DC12: D35.3(D0) D49.5(DI3) D97.2(Q0)
DC13: D35.18(D7) D49.10(DI4) D97.19(Q7)
DC14: D35.17(D6) D49.11(DI5) D97.16(Q6)
DC15: D35.14(D5) D49.12(DI6) D97.15(Q5)
DC16: D35.13(D4) D49.14(DI7) D97.12(Q4)
DC17: D58.2(DI0) D91.9(Q3)
DC18: D58.3(DI1) D91.6(Q2)
DC19: D58.4(DI2) D91.5(Q1)
DC20: D58.5(DI3) D91.2(Q0)
DC21: D58.10(DI4) D91.19(Q7)
DC22: D58.11(DI5) D91.16(Q6)
DC23: D58.12(DI6) D91.15(Q5)
DC24: D58.14(DI7) D91.12(Q4)
DC25: D51.2(DI0) D96.9(Q3)
DC26: D51.3(DI1) D96.6(Q2)
DC27: D51.4(DI2) D96.5(Q1)
DC28: D51.5(DI3) D96.2(Q0)
DC29: D51.10(DI4) D96.19(Q7)
DC30: D51.11(DI5) D96.16(Q6)
DC31: D51.12(DI6) D96.15(Q5)
DC32: D51.14(DI7) D96.12(Q4)
DC33: D39.14(4.0) D58.13(DO)
DC34: D39.2(1.0) D51.13(DO)
DEN1: D117.3(-Q1) D122.1(D1)
DEN2: D117.2(Q1) D122.15(D0)
DIR: D45.10(2) X3.18
DIRC: D33.16(DIR) D45.11(1)
DIRQ: D56.14(-RDB) VD10.2(K)
DTA: D34.10(4) D45.5(1)
DZ: D38.12(1) D38.13(2) J1.2
DZO: D22.5(2) D112.11(3)
EROM: D16.9(1) D23.6(3)
F6: D99.5(Y3) J4.1 ; also on sheet 6
F7: D20.4(1) D20.13(2) D99.4(Y4)
F8: D1.12(1) D93.15(Y0)
F9: D14.13(2) D93.14(Y1)
F-UP: D31.7(Q3) R38.1
FA: D11.5(2) D93.13(Y2)
FB: D93.12(Y3) D111.9(C) D123.3(С) D123.11(C)
FBB: D111.3(D1) ; also on sheet 6
FC: D93.11(Y4) D106.9(1)
FCS1: D15.8(3) D33.3(-CS)
FCS2: D20.8(3) D117.9(C)
FD: D93.10(Y5) ; also on sheet 6
FE: D93.9(Y6) D116.9(C) ; also on sheet 6
FF: D26.3(С) D93.7(Y7) ; also on sheet 6
FR: D111.12(Q5) ; also on sheet 6
G: D39.7(2) D42.9(3) D43.9(3) R26.2 VD18.1(A) X4.7 ; also on sheet 3
GATE: D45.2 X3.24
HLDA: D75.1(EZ) D79.19(OE) D94.1(EZ) D95.1(EZ) D106.12(2) ; also on sheet 3
HOLD: D77.25(-BRQ) NR2.3(R2) ; also on sheet 3
I: D39.9(3) D42.12(4) D43.12(4) R27.2 R55.1 R56.1 R57.1 X4.4 ; also on sheet 3
I-1: D35.9(Q3) D40.9(Q3) D42.3(1.1)
I-2: D35.6(Q2) D40.6(Q2) D42.10(3.1)
I-3: D35.5(Q1) D40.5(Q1) D42.6(2.1)
I-4: D35.2(Q0) D40.2(Q0) D42.13(4.1)
I-5: D35.19(Q7) D40.19(Q7) D42.2(1.0)
I-6: D35.16(Q6) D40.16(Q6) D42.11(3.0)
I-7: D35.15(Q5) D40.15(Q5) D42.5(2.0)
I-8: D35.12(Q4) D40.12(Q4) D42.14(4.0)
ID: D19.8(3) D33.35(-ND)
IDX: D19.9(1) D19.10(2) R21.1 X3.8
INT: D77.16(-INT) R9.1 VD10.1(A) VD11.1(A)
INTT: D41.2(D) D111.15(Q6)
IRQ0: D41.6(&#126;Q) D56.4(-PR7)
IRQ1: D56.11(-PR1) NR2.10(R9) ; also on sheet 3
IRQ2: D56.12(-PR2) NR2.9(R8) ; also on sheet 3
IRQ3: D56.13(-PR3) NR2.8(R7) ; also on sheet 3
IRQ4: D56.3(-PR6) NR2.7(R6) ; also on sheet 3
IRQ5: D56.2(-PR5) NR2.6(R5) ; also on sheet 3
IRQ6: D56.1(-PR4) NR2.5(R4) ; also on sheet 3
IRQ7: D56.10(-PR0) NR2.4(R3) ; also on sheet 3
IRQS: VD11.2(K) ; also on sheet 3
K-RES: C2.2 D30.2(Зап) D30.6(C) J5.2 R7.1 SW1.2 VD6.1(A) ; also on sheet 5
K-RL: D69.10(PC7) ; also on sheet 5
K-SS: D69.12(PC5) ; also on sheet 5
K-US: D69.11(PC6) ; also on sheet 5
KA00: D69.4(PA0) ; also on sheet 5
KA01: D69.3(PA1) ; also on sheet 5
KA02: D69.2(PA2) ; also on sheet 5
KA03: D69.1(PA3) ; also on sheet 5
KA04: D69.40(PA4) ; also on sheet 5
KA05: D69.39(PA5) ; also on sheet 5
KA06: D69.38(PA6) ; also on sheet 5
KA07: D69.37(PA7) ; also on sheet 5
KD00: D69.18(PB0) ; also on sheet 5
KD01: D69.19(PB1) ; also on sheet 5
KD02: D69.20(PB2) ; also on sheet 5
KD03: D69.21(PB3) ; also on sheet 5
KD04: D69.22(PB4) ; also on sheet 5
KD05: D69.23(PB5) ; also on sheet 5
KD06: D69.24(PB6) ; also on sheet 5
KD07: D69.25(PB7) ; also on sheet 5
MA14: D4.7(1) D13.6(1.0) ; also on sheet 3
MA15: D4.9(2) D13.10(2.0) ; also on sheet 3
MA16: D5.7(1) D82.13(A0) R39.1 ; also on sheet 3
MA17: D5.9(2) D109.6(1.0) R40.1 ; also on sheet 3
MA18: D12.7(1) D108.6(1.0) D108.10(2.0) R42.1 ; also on sheet 3
MA19: D12.9(2) R41.1 ; also on sheet 3
MR1: D99.1(Ea) D102.10(3) VD1.2(K)
mz: D123.5(Q) ; also on sheet 6
NMI: D77.17(-NMI) NR1.10(R9)
O1: D37.1 D81.18(PB0)
O2: D37.3(1) D81.19(PB1)
O3: D37.11(1) D81.20(PB2)
O4: D37.13(1) D81.21(PB3)
O5: D37.5(1) D81.22(PB4)
O6: D37.9(1) D81.23(PB5)
O7: D44.11(1) D81.24(PB6)
O8: D44.13(1) D81.25(PB7)
O9: D44.9(1) D81.14(PC0)
O14: D44.4(2) D81.12(PC5) R11.1
O15: D44.2 D81.11(PC6) R12.1
O16: D44.6(2) D81.10(PC7) R13.1
P0: D76.15(Y0) D81.6(-CS) ; also on sheet 6
P1C: D76.7(Y7) ; also on sheet 6
P4: D55.6(-CS) D76.14(Y1)
P8: D76.13(Y2) D80.6(-CS)
P10: D15.10(2) D76.11(Y4)
P14: D15.13(2) D76.10(Y5)
P18: D17.13(2) D76.9(Y6)
QRD: D18.8(3) D79.1(DIR)
R: D39.12(4) D42.7(2) D43.7(2) R25.2 VD17.1(A) X4.3 ; also on sheet 3
RAWR: D1.6(3) D33.27(RWD) D46.11(-V)
RD_DATA: D19.6(3) D27.2(D)
RDATA: D19.4(1) D19.5(2) R22.1 X3.30
RDY: D33.32(CRDY) J10.2
READY: D32.5(1) D32.6(2) J10.1 R19.1 X3.34
REG: D108.1(E1) D113.10(Q3)
ROM: D66.6(5) J9.2 VD8.2(K) ; also on sheet 3
RSUC: D18.2 ; also on sheet 4
S: D33.26(S) D46.7(Q3) D46.9(D3)
S0: D32.1(3) X3.10
S1: D32.13(3) X3.12
S16: D5.3(1.3) D36.9(3)
S17: D5.13(2.3) D36.12(4)
S18: D12.3(1.3) D36.4(1)
S19: D12.13(2.3) D36.7(2)
SIDE: D45.4(2) X3.32
SKD: D26.5(Q) R32.1 R43.1
SOUND: C48.2 R32.2 R34.2 R35.2 R36.2 R37.2 R53.2 R54.2 VT3.3(B) ; also on sheet 3
SR16: D88.2(SE1) D113.15(Q4)
SS0: D111.2(Q1) ; also on sheet 6
SS1: D111.5(Q2) ; also on sheet 6
START: D45.12(2) X3.16
STEP: D45.8(2) X3.20
STP: D33.15(STP) D45.9(1)
SW1: D81.4(PA0) NR1.2(R1) SW8.1(PIN1)
SW2: D81.3(PA1) NR1.3(R2) SW8.2(PIN2)
SW3: D81.2(PA2) NR1.4(R3) SW8.3(PIN3)
SW4: D81.1(PA3) NR1.5(R4) SW8.4(PIN4) ; also on sheet 6
SW5: D81.40(PA4) NR1.6(R5) SW8.5(PIN5)
SW6: D81.39(PA5) NR1.7(R6) SW8.6(PIN6) ; also on sheet 6
SW7: D81.38(PA6) D128.3(1) NR1.8(R7) SW8.7(PIN7)
SW8: D81.37(PA7) D128.5(1) NR1.9(R8) SW8.8(PIN8)
TR0: D19.3 D33.34(-TR0)
TR00: D19.1 D19.2 R20.1 X3.26
VIDEO: C5.2 C7.2 J12.2 X4.6
VS: D10.3 D17.10(2)
WD: D33.31(WD) D34.6(EL)
WP: D19.12(1) D19.13(2) R23.1 X3.28
WPRT: D19.11(3) D33.36(-WRPT)
WSTB: D33.30(WG) D45.1
XROM: D67.20(/CE) J9.1 ; also on sheet 3
XZ5: D114.12(Q5) ; also on sheet 6
XZ6: D114.5(Q2) ; also on sheet 6
ZZ1: D36.10(3.1) D80.4(PA0)
ZZ2: D36.13(4.1) D80.3(PA1)
ZZ3: D36.3(1.1) D80.2(PA2)
ZZ4: D36.6(2.1) D80.1(PA3)
Net-(C1-1): C1.1 D101.13(1) R2.1
Net-(C1-2): C1.2 D101.2 R1.2
Net-(C3-1): C3.1 D101.11(1) R17.1
Net-(C3-2): C3.2 D101.8(2) R16.2
Net-(C5-1): C5.1 C7.1 C9.1 J12.1 R30.2 R31.1
Net-(C6-2): C6.2 D1.4(1) D27.6(&#126;Q)
Net-(C8-1): C8.1 R33.1 VT3.1(E)
Net-(C8-2): C8.2 J11.1
Net-(C9-2): C9.2 R30.1 VT1.1(E)
Net-(D1.2-5): D1.5(2) D27.9(Q)
Net-(D1.4-11): D1.11(3) D110.9(C) D115.3(С)
Net-(D1.4-13): D1.13(2) D99.9(Y5)
Net-(D2-2): D2.2(&) D10.8(3) D88.4(1.2) D88.10(2.0) D88.11(2.1)
Net-(D2-14): D2.14(C1) D88.9(2)
Net-(D6-3): D6.3(R0) D7.3(R0) D118.8(3)
Net-(D11.2-4): D11.4(1) D99.11(Y7)
Net-(D11.3-9): D11.9(1) D25.8(3)
Net-(D11.3-10): D11.10(2) D11.11(3)
Net-(D14.1-3): D14.3 D87.1(R) D87.4(D1)
Net-(D14.3-8): D14.8(3) VD2.2(K)
Net-(D14.3-9): D14.9(1) D104.11(3)
Net-(D14.4-12): D14.12(1) D99.10(Y6)
Net-(D15.1-1): D15.1 D33.18(SR)
Net-(D15.1-2): D15.2 D15.4(1) D33.29(T43)
Net-(D15.1-3): D15.3 D34.2(D1) D120.8(1)
Net-(D15.2-5): D15.5(2) D33.17(SL)
Net-(D15.2-6): D15.6(3) D34.4(D3) D120.9(2)
Net-(D15.3-9): D15.9(1) D20.6(3)
Net-(D15.4-11): D15.11(3) D20.10(2)
Net-(D15.4-12): D15.12(1) D20.11(3)
Net-(D16.1-3): D16.3 D66.2
Net-(D16.2-4): D16.4(1) D16.12(1) D119.12(O)
Net-(D16.2-5): D16.5(2) D119.6(O)
Net-(D16.3-8): D16.8(3) D66.12(3)
Net-(D16.4-13): D16.13(2) D119.8(O)
Net-(D17.1-2): D17.2 D121.13(3)
Net-(D17.1-3): D17.3 D76.6(E3)
Net-(D17.2-5): D17.5(2) D126.6(O)
Net-(D17.2-6): D17.6(3) ; also on sheet 6
Net-(D17.4-12): D17.12(1) J2.2 J3.2 J4.2
Net-(D18.1-1): D18.1 D106.4(2)
Net-(D18.2-6): D18.6(3) D120.6(2)
Net-(D18.4-11): D18.11(3) D28.3(С)
Net-(D20.1-3): D20.3 D20.5(2)
Net-(D20.1-14): D20.14(VCC) D120.14(VCC)
Net-(D20.4-12): D20.12(1) D120.1(3)
Net-(D21.1-3): D21.3 D42.15(E)
Net-(D21.2-6): D21.6(3) D39.1(SE)
Net-(D21.3-8): D21.8(3) D43.11(3.0)
Net-(D21.3-9): D21.9(1) D105.10(2)
Net-(D21.3-10): D21.10(2) D39.5(2.0) D42.1(SE) D43.3(1.1) D50.13(DO) D102.12(2) D107.11(1)
Net-(D21.4-11): D21.11(3) D43.15(E)
Net-(D22.1-1): D22.1 D29.6(&#126;Q) D104.13(2)
Net-(D22.1-3): D22.3 D104.2 D104.5(2)
Net-(D22.2-4): D22.4(1) D29.5(Q)
Net-(D22.2-6): D22.6(3) D104.1 D104.4(1)
Net-(D22.3-8): D22.8(3) VD3.2(K)
Net-(D22.3-10): D22.10(2) D87.10(Q3)
Net-(D22.4-11): D22.11(3) VD4.2(K)
Net-(D22.4-13): D22.13(2) D87.7(Q2) D87.12(D3)
Net-(D23.2-4): D23.4(1) D123.8(-Q)
Net-(D23.3-8): D23.8(3) D93.5(E2)
Net-(D23.3-9): D23.9(1) D100.8
Net-(D23.4-11): D23.11(3) D99.14(Sb)
Net-(D24.2-4): D24.4(1) D28.9(Q)
Net-(D24.2-6): D24.6(3) D28.12(D)
Net-(D24.3-8): D24.8(3) D121.6(2) D121.8(1)
Net-(D24.4-11): D24.11(3) D32.3(2) D32.12(2) D45.13(1)
Net-(D24.4-12): D24.12(1) D33.23(RDY) D33.28(HLD)
Net-(D25.1-1): D25.1 D102.1(3)
Net-(D25.1-2): D25.2 D86.13(2) D89.8 D105.13(1)
Net-(D25.1-3): D25.3 D25.5(2) D86.4(1)
Net-(D25.2-6): D25.6(3) D82.1(Ea) D99.2(Sa)
Net-(D25.4-11): D25.11(3) D82.2(Sa)
Net-(D26.1-2): D26.2(D) D26.6(&#126;Q)
Net-(D26.2-11): D26.11(С) D101.4(2)
Net-(D27.1-3): D27.3(С) D27.11(C) D31.3(Q0) D34.9(C) D46.4(C2)
Net-(D27.1-5): D27.5(Q) D27.12(D)
Net-(D28.1-4): D28.4(S) D107.8(2)
Net-(D30-3): D30.3(Вых) D106.3(1)
Net-(D31-6): D31.6(Q2) D33.24(CLK)
Net-(D32.1-2): D32.2(1) D117.14(-Q4)
Net-(D32.2-4): D32.4(3) J10.3 R18.1
Net-(D32.4-11): D32.11(1) D117.15(Q4)
Net-(D33-22): D33.22(-TST) R15.2
Net-(D34-3): D34.3(D2) D120.10(3)
Net-(D36-1): D36.1(SE) D101.6(2)
Net-(D36-2): D36.2(1.0) D114.15(Q6)
Net-(D36-5): D36.5(2.0) D114.10(Q4)
Net-(D36-11): D36.11(3.0) D114.7(Q3)
Net-(D36-14): D36.14(4.0) D114.2(Q1)
Net-(D37.1-2): D37.2 X1.2(D0)
Net-(D37.2-4): D37.4(2) X1.3(D1)
Net-(D37.3-6): D37.6(2) X1.6(D4)
Net-(D37.4-8): D37.8(2) X1.7(D5)
Net-(D37.5-10): D37.10(2) X1.4(D2)
Net-(D37.6-12): D37.12(2) X1.5(D3)
Net-(D38.1-2): D38.2 D48.6(&#126;Q)
Net-(D38.1-3): D38.3 D112.2 D112.5(2)
Net-(D38.2-6): D38.6(3) D112.9(1)
Net-(D38.3-8): D38.8(3) D112.12(1) D112.13(2)
Net-(D38.3-9): D38.9(1) D38.10(2) D38.11(3)
Net-(D39-11): D39.11(3.0) D43.1(SE) D49.13(DO)
Net-(D39-15): D39.15(E) D120.4(3)
Net-(D41.1-1): D41.1(R) D41.8(-Q)
Net-(D41.1-5): D41.5(Q) D41.13(R)
Net-(D43-2): D43.2(1.0) D43.5(2.0) D102.13(3)
Net-(D43-6): D43.6(2.1) D107.10(2)
Net-(D44.1-1): D44.1 X1.15(Error)
Net-(D44.2-3): D44.3(1) X1.12(PaperOut)
Net-(D44.3-5): D44.5(1) X1.11(-Busy)
Net-(D44.4-8): D44.8(2) X1.1(-Strobe)
Net-(D44.5-10): D44.10(2) X1.8(D6)
Net-(D44.6-12): D44.12(2) X1.9(D7)
Net-(D45.2-3): D45.3(1) D117.11(-Q3)
Net-(D47.1-2): D47.2(D) D112.3
Net-(D47.2-12): D47.12(D) D112.6(3)
Net-(D48.1-2): D48.2(D) D112.8(3)
Net-(D48.2-8): D48.8(-Q) D112.10(2)
Net-(D48.2-11): D48.11(C) D83.6(&#126;Q) D112.4(1)
Net-(D56-6): D56.6(-B3) D68.15(B3)
Net-(D56-7): D56.7(-B2) D68.16(B2)
Net-(D56-9): D56.9(-B1) D68.17(B1)
Net-(D66.1-1): D66.1 D66.13(4) D107.2 D119.2(I2) D119.4(I2)
Net-(D66.1-4): D66.4(3) D66.10(2) D107.4(2) D119.10(I2) D119.13(I3)
Net-(D66.2-8): D66.8(5) D78.20(/CE) VD9.2(K)
Net-(D66.2-9): D66.9(1) D107.6(2)
Net-(D67-1): D67.1(A15) J8.2
Net-(D67-26): D67.26(A13) J6.2
Net-(D67-27): D67.27(A14) J7.2
Net-(D77-7): D77.7(D4) D79.9(A7)
Net-(D77-8): D77.8(D3) D79.8(A6)
Net-(D77-9): D77.9(D5) D79.7(A5)
Net-(D77-10): D77.10(D6) D79.6(A4)
Net-(D77-12): D77.12(D2) D79.5(A3)
Net-(D77-13): D77.13(D7) D79.4(A2)
Net-(D77-14): D77.14(D0) D79.3(A1)
Net-(D77-15): D77.15(D1) D79.2(A0)
Net-(D77-23): D77.23(-BSAK) D106.13(1)
Net-(D82-14): D82.14(Sb) D86.6(3)
Net-(D83.1-5): D83.5(Q) D83.12(D)
Net-(D85-8): D85.8 D86.12(1)
Net-(D86.1-1): D86.1 D105.12(2)
Net-(D86.1-3): D86.3 D99.15(Eb)
Net-(D87-2): D87.2(Q1) D87.5(D2)
Net-(D88-7): D88.7(1) D103.2(I2)
Net-(D99-6): D99.6(Y2) J3.1
Net-(D99-7): D99.7(Y1) J2.1
Net-(D101.1-1): D101.1 Q1.2(OSC2) R1.1
Net-(D101.2-3): D101.3(1) D101.12(2) Q1.1(OSC1) R2.2
Net-(D101.4-9): D101.9(1) Q2.2(OSC2) R16.1
Net-(D102.2-4): D102.4(3) D105.3(1)
Net-(D102.3-8): D102.8(1) D106.2
Net-(D105.4-8): D105.8(2) D121.9(2)
Net-(D116-2): D116.2(Q1) R34.1
Net-(D116-5): D116.5(Q2) R53.1
Net-(D116-7): D116.7(Q3) R35.1
Net-(D116-10): D116.10(Q4) R36.1
Net-(D116-12): D116.12(Q5) R54.1
Net-(D116-15): D116.15(Q6) R37.1
Net-(D118.1-3): D118.3 D118.12(1)
Net-(D122-11): D122.11(-V) D122.13(-B)
Net-(D128.1-2): D128.2 ; also on sheet 6
Net-(D128.2-4): D128.4(2) ; also on sheet 6
Net-(D128.3-6): D128.6(2) ; also on sheet 6
Net-(D128.4-8): D128.8(2) ; also on sheet 6
Net-(D128.6-12): D128.12(2) ; also on sheet 6
Net-(L1-2): L1.2 VD12.1(A) VT2.2(C)
Net-(R24-1): R24.1 R25.1 R26.1 R27.1 R28.2 R29.1 VD5.1(A) VT1.3(B)
Net-(R38-2): R38.2 VT2.3(B)
Net-(R55-2): R55.2 VD16.2(K)
Net-(R56-2): R56.2 VD17.2(K)
Net-(R57-2): R57.2 VD18.2(K)

Not connected (* = marked no-connect by the designer): D1 1* 2* 3* 7(GND) 8(3)* 9(1)* 10(2)* 14(VCC); D2 5(VCC) 10(GND); D3 5(VCC) 10(GND); D4 8(GND) 16(VCC); D5 8(GND) 16(VCC); D6 5(VCC) 10(GND); D7 5(VCC) 10(GND) 12(1)* 14(C1)*; D8 8(GND) 16(VCC); D9 8(GND) 16(VCC); D10 7(GND) 11(3)* 12(1)* 13(2)* 14(VCC); D11 1* 2* 3* 7(GND) 14(VCC); D12 8(GND) 16(VCC); D13 8(GND) 16(VCC); D14 4(1)* 5(2)* 6(3)* 7(GND) 14(VCC); D15 7(GND) 14(VCC); D16 7(GND) 14(VCC); D17 7(GND) 14(VCC); D18 7(GND) 14(VCC); D19 7(GND) 14(VCC); D20 7(GND); D21 7(GND) 14(VCC); D22 7(GND) 14(VCC); D23 7(GND) 14(VCC); D24 7(GND) 14(VCC); D25 7(GND) 14(VCC); D26 7(GND) 14(VCC); D27 7(GND) 8(-Q)* 14(VCC); D28 6(&#126;Q)* 7(GND) 14(VCC); D29 7(GND) 8(-Q)* 9(Q)* 10(S)* 11(C)* 12(D)* 14(VCC); D30 5(K)* 7(P)*; D31 1(D1)* 2(Q1)* 8(GND) 9(D3)* 10(D2)* 12(-P)* 13(-B)* 15(D0)* 16(VCC); D32 7(GND) 8(1)* 9(2)* 10(3)* 14(VCC); D33 20(GND) 21(VCC) 33(-VFOE)* 38(DRQ)* 39(INT)*; D34 7(GND) 11(3)* 12(2)* 13(1)* 14(VCC); D35 10(GND) 20(VCC); D36 8(GND) 16(VCC); D37 7(GND) 14(VCC); D38 7(GND) 14(VCC); D39 8(GND) 16(VCC); D40 10(GND) 20(VCC); D41 7(GND) 9(Q)* 14(VCC); D42 8(GND) 16(VCC); D43 8(GND) 16(VCC); D44 7(GND) 14(VCC); D45 7(GND) 14(VCC); D46 2(Q1)* 3(Q0)* 6(Q2)* 8(GND) 12(-P)* 13(-B)* 16(VCC); D47 5(Q)* 7(GND) 9(Q)* 14(VCC); D48 5(Q)* 7(GND) 9(Q)* 14(VCC); D49 1(D->)* 8(GND) 16(VCC); D50 1(D->)* 8(GND) 16(VCC); D51 1(D->)* 8(GND) 16(VCC); D52 8(VCC) 16(GND); D53 8(VCC) 16(GND); D54 8(VCC) 16(GND); D55 7(GND) 10(PC7)* 11(PC6)* 24(PB6)* 25(PB7)* 26(VCC) 37(PA7)* 38(PA6)*; D56 8(GND) 15(-WI)* 16(VCC); D57 8(VCC) 16(GND); D58 1(D->)* 8(GND) 16(VCC); D59 8(VCC) 16(GND); D60 8(VCC) 16(GND); D61 8(VCC) 16(GND); D62 8(VCC) 16(GND); D63 8(VCC) 16(GND); D64 8(VCC) 16(GND); D65 8(VCC) 16(GND); D66 7(GND) 14(VCC); D67 14(GND) 28(VCC); D68 10(GND) 20(VCC); D69 7(GND) 13(PC4)* 14(PC0)* 15(PC1)* 16(PC2)* 17(PC3)* 26(VCC); D70 8(VCC) 16(GND); D71 8(VCC) 16(GND); D72 8(VCC) 16(GND); D73 8(VCC) 16(GND); D74 8(VCC) 16(GND); D75 10(GND) 12(Q4)* 13(D4)* 14(D5)* 15(Q5)* 20(VCC); D76 8(GND) 12(Y3)* 16(VCC); D77 11(VCC) 18(-HALT)* 29(GND); D78 14(GND) 28(VCC); D79 10(GND) 20(VCC); D80 7(GND) 26(VCC) 37(PA7)* 38(PA6)* 39(PA5)* 40(PA4)*; D81 7(GND) 13(PC4)* 15(PC1)* 16(PC2)* 17(PC3)* 26(VCC); D82 4(Y4)* 5(Y3)* 8(GND) 11(Y7)* 12(Y8)* 16(VCC); D83 7(GND) 14(VCC); D84 5(VCC) 10(GND) 11(8)*; D85 7(GND) 14(VCC); D86 7(GND) 14(VCC); D87 3(-Q1)* 6(-Q2)* 8(GND) 11(-Q3)* 13(D4)* 14(-Q4)* 15(Q4)* 16(VCC); D88 8(GND) 16(VCC); D89 7(GND) 14(VCC); D90 10(GND) 20(VCC); D91 10(GND) 20(VCC); D92 10(GND) 20(VCC); D93 8(GND) 16(VCC); D94 10(GND) 20(VCC); D95 10(GND) 20(VCC); D96 10(GND) 20(VCC); D97 10(GND) 20(VCC); D98 10(GND) 20(VCC); D99 8(GND) 12(Y8)* 16(VCC); D100 7(GND) 14(VCC); D101 7(GND) 14(VCC); D102 7(GND) 14(VCC); D103 3(I1)* 4(I2)* 5(I3)* 6(O)* 7(GND) 14(VCC); D104 7(GND) 14(VCC); D105 1* 2* 7(GND) 14(VCC); D106 5(1)* 6(2)* 7(GND) 14(VCC); D107 7(GND) 14(VCC); D108 8(GND) 16(VCC); D109 8(GND) 16(VCC); D110 6(-Q2)* 8(GND) 11(-Q3)* 15(Q4)* 16(VCC); D111 8(GND) 16(VCC); D112 7(GND) 14(VCC); D113 3(-Q1)* 7(Q2)* 8(GND) 11(-Q3)* 14(-Q4)* 16(VCC); D114 8(GND) 16(VCC); D115 7(GND) 14(VCC); D116 8(GND) 16(VCC); D117 6(-Q2)* 7(Q2)* 8(GND) 10(Q3)* 16(VCC); D118 7(GND) 14(VCC); D119 7(GND) 14(VCC); D120 7(GND) 11(1)* 12(2)* 13(3)*; D121 1(3)* 2(1)* 3(2)* 7(GND) 14(VCC); D122 3(Q0)* 6(Q2)* 7(Q3)* 8(GND) 12(-P)* 16(VCC); D123 6(&#126;Q)* 7(GND) 9(Q)* 14(VCC); D126 1(I1)* 2(I2)* 3(I1)* 7(GND) 8(O)* 9(I1)* 10(I2)* 11(I3)* 12(O)* 13(I3)* 14(VCC); D128 1* 7(GND) 9(1)* 10(2)* 11(1)* 13(1)* 14(VCC); NR2 2(R1)*; X1 10(Ack)* 13(Select)* 14(-LineFeed)* 16(Reset)* 17(Select)*; X3 2* 4* 6* 14*

## Notes on the sheets
sheet 1
- Orion-PRO версия 3.21
- Порт F800, F8
  Режим дисплея
- Кнопка "RESET"
- Свободные элементы
- Опционально, подмешивание
  I к RGB для SCART
- O10
- O11
- O12
- O13
sheet 2
- Orion-PRO Динамическое ОЗУ
- PAGE-0
- PAGE-1
